# Altium project RPi_sensor_expansion_board.PrjPCB
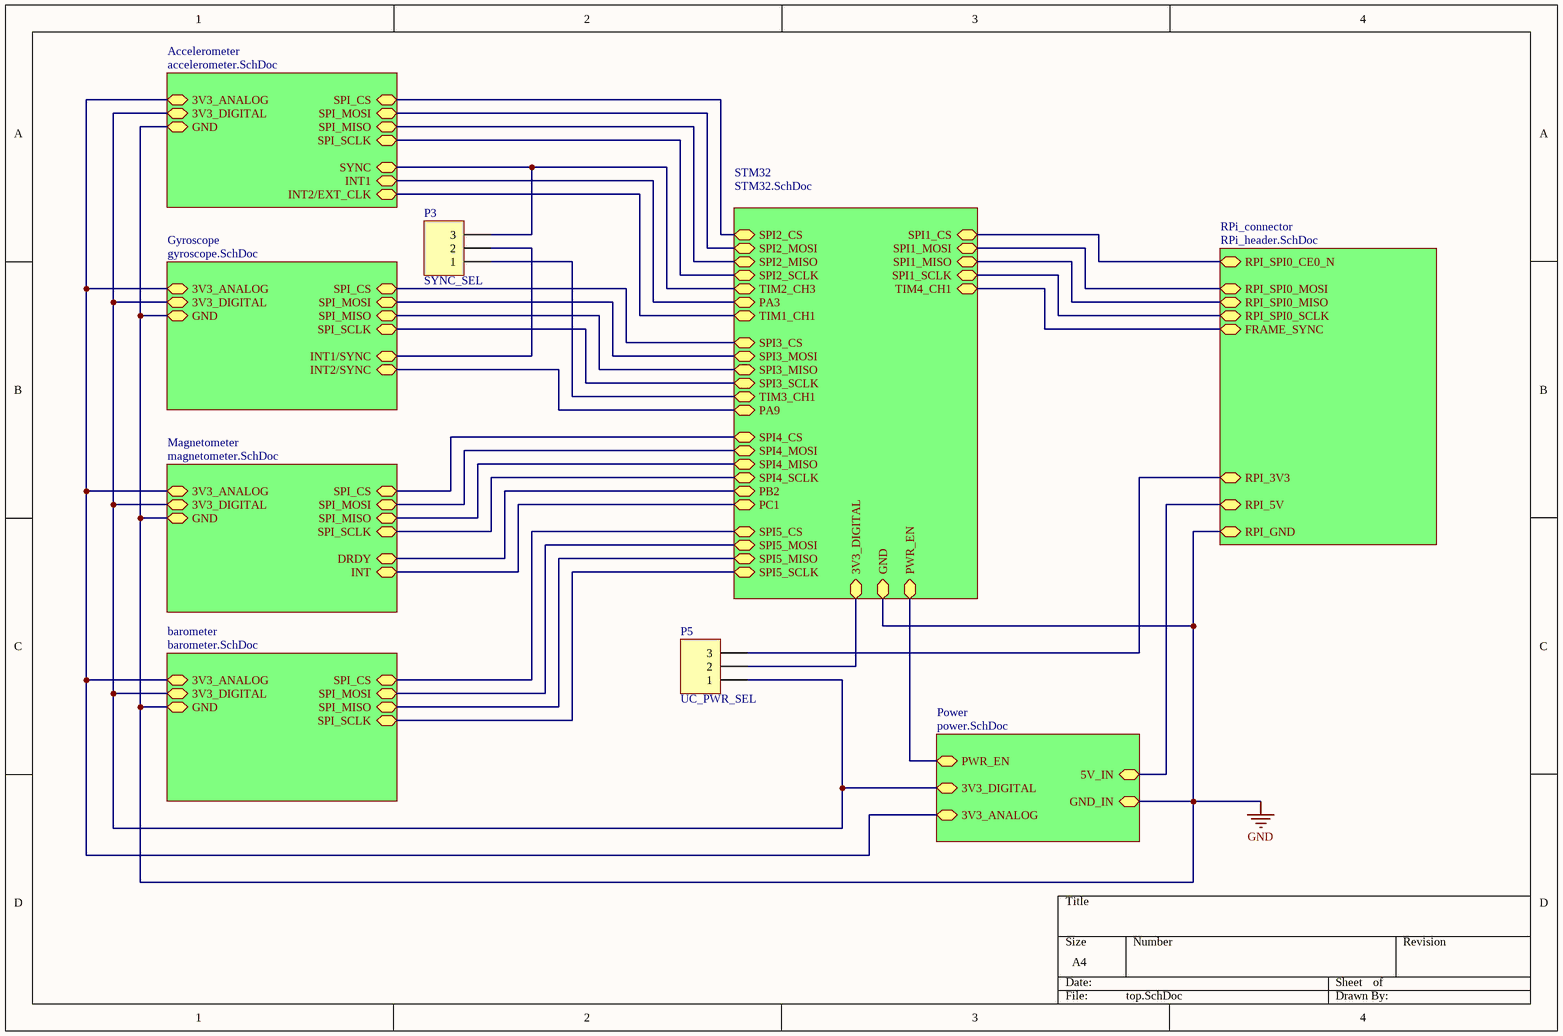
[diagram p0: top.SchDoc]
3 sheets, 10 parts. Net scope: hierarchical (ports join the sheet entries above them; power ports are global).
Board file: RPi_sensor_expansion_board.PcbDoc
Sheets:
  top.SchDoc
    Gyroscope = gyroscope.SchDoc
    barometer = barometer.SchDoc

## Sheet top.SchDoc
size A4

### Parts
P3  SYNC_SEL  [HDR1X3]
P5  UC_PWR_SEL  [HDR1X3]

### Sub-sheets
Accelerometer = accelerometer.SchDoc (file not in this document): 3V3_ANALOG, 3V3_DIGITAL, GND, INT1, INT2/EXT_CLK, SYNC, SPI_CS, SPI_MOSI, SPI_SCLK, SPI_MISO
barometer = barometer.SchDoc: 3V3_DIGITAL, 3V3_ANALOG, GND, SPI_MISO, SPI_CS, SPI_MOSI, SPI_SCLK
Gyroscope = gyroscope.SchDoc: GND, 3V3_ANALOG, 3V3_DIGITAL, INT2/SYNC, SPI_MOSI, SPI_MISO, SPI_SCLK, INT1/SYNC, SPI_CS
Magnetometer = magnetometer.SchDoc (file not in this document): 3V3_ANALOG, GND, SPI_SCLK, SPI_MOSI, SPI_CS, DRDY, INT, SPI_MISO, 3V3_DIGITAL
Power = power.SchDoc (file not in this document): 3V3_DIGITAL, 3V3_ANALOG, 5V_IN, GND_IN, PWR_EN
RPi_connector = RPi_header.SchDoc (file not in this document): RPI_SPI0_MOSI, RPI_SPI0_MISO, FRAME_SYNC, RPI_SPI0_SCLK, RPI_SPI0_CE0_N, RPI_5V, RPI_GND, RPI_3V3
STM32 = STM32.SchDoc (file not in this document): 3V3_DIGITAL, GND, TIM4_CH1, SPI4_MOSI, SPI5_SCLK, SPI5_CS, SPI4_CS, SPI4_SCLK, SPI5_MOSI, SPI1_MISO, SPI1_MOSI, SPI2_MISO, SPI2_MOSI, SPI2_SCLK, SPI3_MISO, SPI3_MOSI, SPI1_SCLK, SPI1_CS, SPI2_CS, SPI3_SCLK, SPI3_CS, TIM1_CH1, TIM2_CH3, TIM3_CH1, SPI4_MISO, SPI5_MISO, PA3, PA9, PB2, PC1, PWR_EN

### Nets
GND: sheet RPi_connector/RPI_GND, sheet STM32/GND, sheet Accelerometer/GND, sheet Power/GND_IN, sheet Gyroscope/GND, sheet Magnetometer/GND, sheet barometer/GND
VCC: P5.1 ; sheet Accelerometer/3V3_DIGITAL, sheet Power/3V3_DIGITAL, sheet Gyroscope/3V3_DIGITAL, sheet Magnetometer/3V3_DIGITAL, sheet barometer/3V3_DIGITAL
3V3_ANALOG: sheet Accelerometer/3V3_ANALOG, sheet Power/3V3_ANALOG, sheet Gyroscope/3V3_ANALOG, sheet Magnetometer/3V3_ANALOG, sheet barometer/3V3_ANALOG
NetMEMS1_4: P3.2 ; sheet Gyroscope/INT1/SYNC
NetMEMS1_5: sheet STM32/SPI3_CS, sheet Gyroscope/SPI_CS
NetMEMS1_7: sheet STM32/SPI3_SCLK, sheet Gyroscope/SPI_SCLK
NetMEMS1_8: sheet STM32/SPI3_MISO, sheet Gyroscope/SPI_MISO
NetMEMS1_9: sheet STM32/SPI3_MOSI, sheet Gyroscope/SPI_MOSI
NetMEMS1_12: sheet STM32/PA9, sheet Gyroscope/INT2/SYNC
NetMEMS4_2: sheet STM32/SPI5_CS, sheet barometer/SPI_CS
NetMEMS4_3: sheet STM32/SPI5_MOSI, sheet barometer/SPI_MOSI
NetMEMS4_4: sheet STM32/SPI5_SCLK, sheet barometer/SPI_SCLK
NetMEMS4_5: sheet STM32/SPI5_MISO, sheet barometer/SPI_MISO
NetP3_1: P3.1 ; sheet STM32/TIM3_CH1
NetP3_3: P3.3 ; sheet STM32/TIM2_CH3, sheet Accelerometer/SYNC
NetP5_2: P5.2 ; sheet STM32/3V3_DIGITAL
NetP5_3: P5.3 ; sheet RPi_connector/RPI_3V3
(unnamed): sheet RPi_connector/RPI_SPI0_MOSI, sheet STM32/SPI1_MOSI
(unnamed): sheet RPi_connector/RPI_SPI0_MISO, sheet STM32/SPI1_MISO
(unnamed): sheet RPi_connector/FRAME_SYNC, sheet STM32/TIM4_CH1
(unnamed): sheet RPi_connector/RPI_SPI0_SCLK, sheet STM32/SPI1_SCLK
(unnamed): sheet RPi_connector/RPI_SPI0_CE0_N, sheet STM32/SPI1_CS
(unnamed): sheet RPi_connector/RPI_5V, sheet Power/5V_IN
(unnamed): sheet STM32/SPI4_MOSI, sheet Magnetometer/SPI_MOSI
(unnamed): sheet STM32/SPI4_CS, sheet Magnetometer/SPI_CS
(unnamed): sheet STM32/SPI4_SCLK, sheet Magnetometer/SPI_SCLK
(unnamed): sheet STM32/SPI2_MISO, sheet Accelerometer/SPI_MISO
(unnamed): sheet STM32/SPI2_MOSI, sheet Accelerometer/SPI_MOSI
(unnamed): sheet STM32/SPI2_SCLK, sheet Accelerometer/SPI_SCLK
(unnamed): sheet STM32/SPI2_CS, sheet Accelerometer/SPI_CS
(unnamed): sheet STM32/TIM1_CH1, sheet Accelerometer/INT2/EXT_CLK
(unnamed): sheet STM32/SPI4_MISO, sheet Magnetometer/SPI_MISO
(unnamed): sheet STM32/PA3, sheet Accelerometer/INT1
(unnamed): sheet STM32/PB2, sheet Magnetometer/DRDY
(unnamed): sheet STM32/PC1, sheet Magnetometer/INT
(unnamed): sheet STM32/PWR_EN, sheet Power/PWR_EN

### Library data of the parts
P3 P5 = Header 3: Header, 3-Pin; LatestRevisionDate: 17-Jul-2002; LatestRevisionNote: Re-released for DXP Platform.; Publisher: Altium Limited

## Sheet gyroscope.SchDoc
size A4
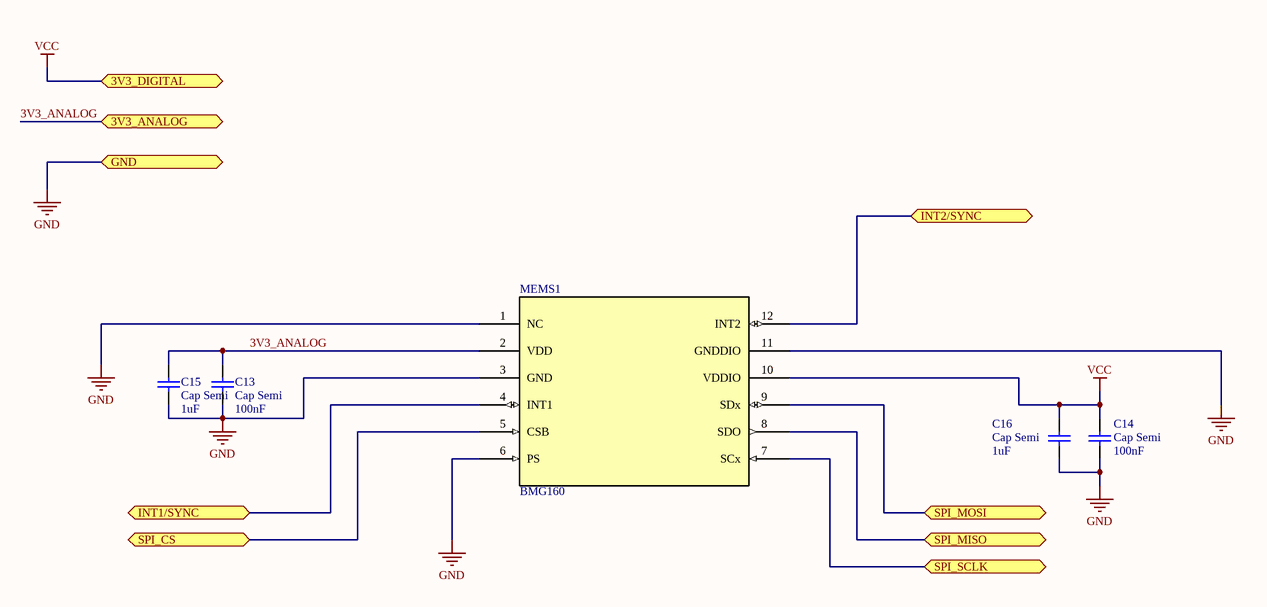
[diagram p1: gyroscope.SchDoc]

### Parts
C13  Cap Semi  value 100nF  [C1206]
C14  Cap Semi  value 100nF  [C1206]
C15  Cap Semi  value 1uF  [C1210]
C16  Cap Semi  value 1uF  [C1210]
MEMS1  BMG160  [LGA12-BOSCH]

### Ports
3V3_ANALOG, 3V3_DIGITAL, GND, INT1/SYNC, INT2/SYNC, SPI_CS, SPI_MISO, SPI_MOSI, SPI_SCLK

### Nets
GND: C13.1 C14.1 C15.1 C16.1 MEMS1.1(NC) MEMS1.3(GND) MEMS1.6(PS) MEMS1.11(GNDDIO) ; port GND
VCC: C14.2 C16.2 MEMS1.10(VDDIO) ; port 3V3_DIGITAL
3V3_ANALOG: C13.2 C15.2 MEMS1.2(VDD) ; port 3V3_ANALOG
NetMEMS1_4: MEMS1.4(INT1) ; port INT1/SYNC
NetMEMS1_5: MEMS1.5(CSB) ; port SPI_CS
NetMEMS1_7: MEMS1.7(SCx) ; port SPI_SCLK
NetMEMS1_8: MEMS1.8(SDO) ; port SPI_MISO
NetMEMS1_9: MEMS1.9(SDx) ; port SPI_MOSI
NetMEMS1_12: MEMS1.12(INT2) ; port INT2/SYNC

### Library data of the parts
C13-C16 = Cap Semi: Capacitor (Semiconductor SIM Model); Published: 8-Jun-2000; LatestRevisionDate: 29-May-2009; LatestRevisionNote: IPC-7351 Footprint Added.; PackageReference: C1206; Publisher: Altium Limited; PackageDescription: Chip Capacitor

## Sheet barometer.SchDoc
size A4
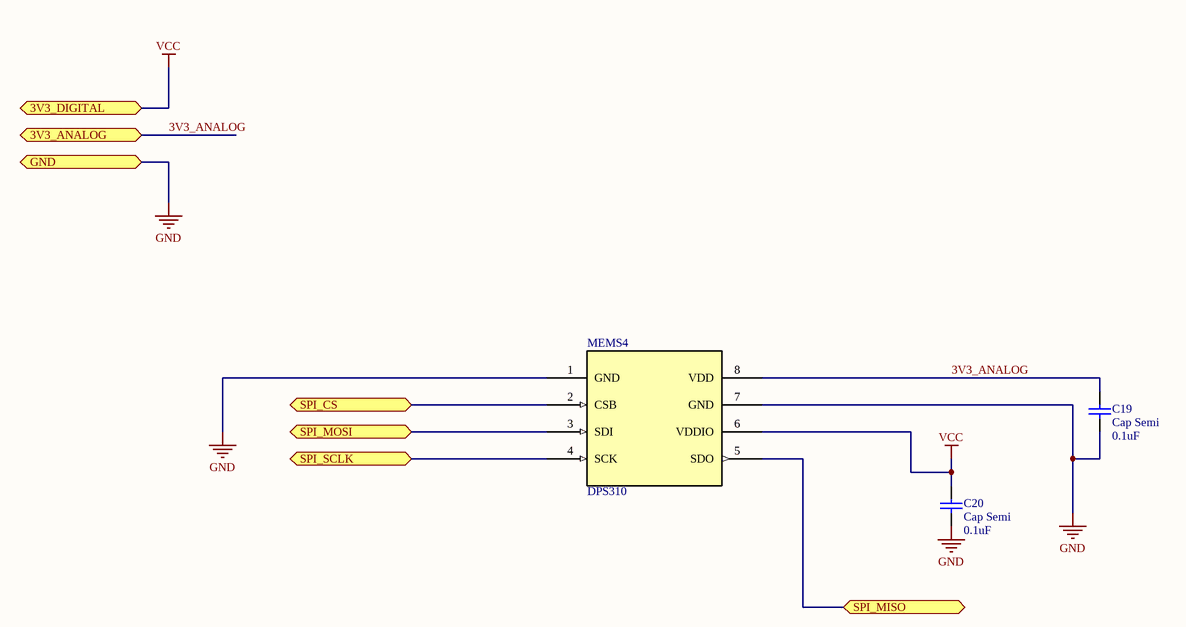
[diagram p2: barometer.SchDoc]

### Parts
C19  Cap Semi  value 0.1uF  [C1206]
C20  Cap Semi  value 0.1uF  [C1206]
MEMS4  DPS310  [PG-VLGA-8-1]

### Ports
3V3_ANALOG, 3V3_DIGITAL, GND, SPI_CS, SPI_MISO, SPI_MOSI, SPI_SCLK

### Nets
GND: C19.1 C20.1 MEMS4.1(GND) MEMS4.7(GND) ; port GND
VCC: C20.2 MEMS4.6(VDDIO) ; port 3V3_DIGITAL
3V3_ANALOG: C19.2 MEMS4.8(VDD) ; port 3V3_ANALOG
NetMEMS4_2: MEMS4.2(CSB) ; port SPI_CS
NetMEMS4_3: MEMS4.3(SDI) ; port SPI_MOSI
NetMEMS4_4: MEMS4.4(SCK) ; port SPI_SCLK
NetMEMS4_5: MEMS4.5(SDO) ; port SPI_MISO

### Library data of the parts
C19 C20 = Cap Semi: Capacitor (Semiconductor SIM Model); Published: 8-Jun-2000; LatestRevisionDate: 29-May-2009; LatestRevisionNote: IPC-7351 Footprint Added.; PackageReference: C1206; Publisher: Altium Limited; PackageDescription: Chip Capacitor

## Nets that join several sheets
GND: gyroscope (8 pins), barometer (C19.1 C20.1 MEMS4.1 MEMS4.7)
VCC: top (P5.1), gyroscope (C14.2 C16.2 MEMS1.10), barometer (C20.2 MEMS4.6)
3V3_ANALOG: gyroscope (C13.2 C15.2 MEMS1.2), barometer (C19.2 MEMS4.8)
NetMEMS1_4: top (P3.2), gyroscope (MEMS1.4)